# Altium project opm.PrjPcb (part 10 of 11)

## Sheet regulation.SchDoc: Power Regulation
size A4; Author: Peilin Perry Xu; CompanyName: N/A; DrawnBy: Peilin Perry Xu; Engineer: Peilin Perry Xu; Organization: N/A; Address1: 89 Chestnut Street, Toronto, ON, Canada; Address2: 79 Brass Drive, Richmond Hill, ON, Canada; DocumentNumber: 6; Revision: 1; SheetNumber: 9; SheetTotal: 11
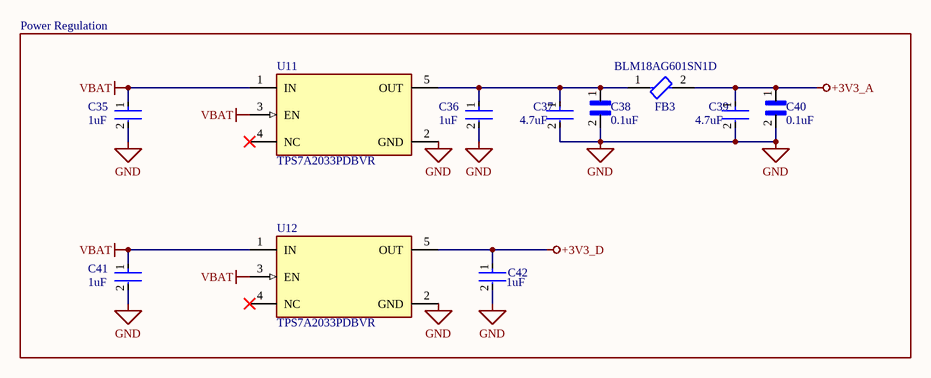
[diagram p9: regulation.SchDoc]

### Parts
C35  1uF  [CC0805KKX7R7BB106]
C36  1uF  [CC0805KKX7R7BB106]
C37  4.7uF  [CC0805KKX7R7BB106]
C38  0.1uF  [CC0603JRX7R8BB104]
C39  4.7uF  [CC0805KKX7R7BB106]
C40  0.1uF  [CC0603JRX7R8BB104]
C41  1uF  [CC0805KKX7R7BB106]
C42  1uF  [CC0805KKX7R7BB106]
FB3  BLM18AG601SN1D  [BLM18AG601SN1D]
U11  TPS7A2033PDBVR  [TPS7A2033PDBVR]
U12  TPS7A2033PDBVR  [TPS7A2033PDBVR]

### Blocks framed on the sheet
Power Regulation: C35-C42 FB3 U11 U12

### Nets
+3V3_A: C39.1 C40.1 FB3.2
+3V3_D: C42.1 U12.5(OUT)
GND: C35.2 C36.2 C37.2 C38.2 C39.2 C40.2 C41.2 C42.2 U11.2(GND) U12.2(GND)  [project net DGND]
VBAT: C35.1 C41.1 U11.1(IN) U11.3(EN) U12.1(IN) U12.3(EN)
NetC36_1: C36.1 C37.1 C38.1 FB3.1 U11.5(OUT)

Not connected (* = marked no-connect by the designer): U11 4(NC)*; U12 4(NC)*

### Library data of the parts
C35 C36 C41 C42 = CC0805KKX7R7BB105: 16V 1uF X7R ±10% 0805 Multilayer Ceramic Capacitors MLCC - SMD/SMT ROHS; Manufacturer: Yageo Group; Manufacturer Package Identifier: CC0805-0.85; Value: 1µF; Supplier: DigiKey; Supplier Part Number: 311-1365-1-ND; Manufacturer Part Number: CC0805KKX7R7BB105; RoHS: Compliant; Category: Ceramic Capacitors; Stock: 898629; Pricing: 1=0.13, 10=0.072, 50=0.05, 100=0.0434, 500=0.0323, 1000=0.02889 (USD); Case/Package: 0805; Case Code (Imperial): 0805; Case Code (Metric): 2012; China RoHS: Compliant; Country of Origin: Mainland China, Taiwan; Depth: 1.25mm; Dielectric: X7R; Dielectric Material: Ceramic; Export Control Classification Number (ECCN) Code: EAR99; Halogen Free: Halogen Free; Height: 1.25mm; Harmonized Tariff Schedule (HTS) Code: 8532.24.00.20; Introduction Date: 2009-04-17; Lead Free: Lead Free; Length: 2mm; Lifecycle Status: Production; Material: Ceramic; Max Operating Temperature: 125°C; Min Operating Temperature: -55°C; Mounting Technology: Surface Mount; Pins: 2; Number of Terminals: 2; Radiation Hardening: No; REACH SVHC: Yes; Schedule B: 8532240020, 8532240020|8532240020|8532240020|8532240020|8532240020|8532240020|8532240020|8532240020|8532240020|8532240020|8532240020|8532240020, 8532240020|8532240020|8532240020|8532240020|8532240020|8532240020|8532240020|8532240020|8532240020|8532240020|8532240020|8532240020|8532240020, 8532240020|8532240020|8532240020|8532240020|8532240020|8532240020|8532240020|8532240020|8532240020|8532240020|8532240020|8532240020|8532240020|8532240020; Termination: SMD/SMT; Thickness: 1.2446mm; Tolerance: 10%; Voltage Rating: 16V; Voltage Rating (DC): 16V; Width: 1.25mm; ComponentLink1URL: https://datasheet.octopart.com:443/CC0805KKX7R7BB105-Yageo-datasheet-177165144.pdf?src-supplier=IHS; ComponentLink1Description: https://datasheet.octopart.com:443/CC0805KKX7R7BB105-Yageo-datasheet-177165144.pdf?src-supplier=IHS; ComponentLink2URL: https://datasheet.octopart.com:443/CC0805KKX7R7BB105-Yageo-datasheet-78855689.pdf?src-supplier=Upverter; ComponentLink2Description: https://datasheet.octopart.com:443/CC0805KKX7R7BB105-Yageo-datasheet-78855689.pdf?src-supplier=Upverter; ComponentLink3URL: https://datasheet.octopart.com:443/CC0805KKX7R7BB105-Yageo-Group-datasheet-189192896.pdf?src-supplier=Future+Electronics; ComponentLink3Description: https://datasheet.octopart.com:443/CC0805KKX7R7BB105-Yageo-Group-datasheet-189192896.pdf?src-supplier=Future+Electronics; ComponentLink4URL: https://datasheet.octopart.com:443/CC0805KKX7R7BB105-Yageo-datasheet-166511530.pdf?src-supplier=Future+Electronics; ComponentLink4Description: https://datasheet.octopart.com:443/CC0805KKX7R7BB105-Yageo-datasheet-166511530.pdf?src-supplier=Future+Electronics; ComponentLink5URL: https://datasheet.octopart.com:443/CC0805KKX7R7BB105-Yageo-datasheet-137700082.pdf?src-supplier=Future+Electronics; ComponentLink5Description: https://datasheet.octopart.com:443/CC0805KKX7R7BB105-Yageo-datasheet-137700082.pdf?src-supplier=Future+Electronics; ComponentLink6URL: https://datasheet.octopart.com:443/CC0805KKX7R7BB105-Yageo-datasheet-137700084.pdf?src-supplier=Future+Electronics; ComponentLink6Description: https://datasheet.octopart.com:443/CC0805KKX7R7BB105-Yageo-datasheet-137700084.pdf?src-supplier=Future+Electronics; ComponentLink7URL: https://datasheet.octopart.com:443/CC0805KKX7R7BB105-Yageo-datasheet-27626582.pdf?src-supplier=Future+Electronics; ComponentLink7Description: https://datasheet.octopart.com:443/CC0805KKX7R7BB105-Yageo-datasheet-27626582.pdf?src-supplier=Future+Electronics; ComponentLink8URL: https://datasheet.octopart.com:443/CC0805KKX7R7BB105-Yageo-datasheet-15895757.pdf?src-supplier=Future+Electronics; ComponentLink8Description: https://datasheet.octopart.com:443/CC0805KKX7R7BB105-Yageo-datasheet-15895757.pdf?src-supplier=Future+Electronics; ComponentLink9URL: https://datasheet.octopart.com:443/CC0805KKX7R7BB105-Yageo-datasheet-12526321.pdf?src-supplier=Future+Electronics; ComponentLink9Description: https://datasheet.octopart.com:443/CC0805KKX7R7BB105-Yageo-datasheet-12526321.pdf?src-supplier=Future+Electronics; ComponentLink10URL: https://datasheet.octopart.com:443/CC0805KKX7R7BB105-Yageo-datasheet-10911834.pdf?src-supplier=Future+Electronics; ComponentLink10Description: https://datasheet.octopart.com:443/CC0805KKX7R7BB105-Yageo-datasheet-10911834.pdf?src-supplier=Future+Electronics; ComponentLink11URL: https://datasheet.octopart.com:443/CC0805KKX7R7BB105-Yageo-datasheet-8324442.pdf?src-supplier=Future+Electronics; ComponentLink11Description: https://datasheet.octopart.com:443/CC0805KKX7R7BB105-Yageo-datasheet-8324442.pdf?src-supplier=Future+Electronics; ComponentLink12URL: https://datasheet.octopart.com/CC0805KKX7R7BB105-Yageo-datasheet-10883670.pdf; ComponentLink12Description: https://datasheet.octopart.com/CC0805KKX7R7BB105-Yageo-datasheet-10883670.pdf; ComponentLink13URL: https://datasheet.octopart.com:443/CC0805KKX7R7BB105-Yageo-datasheet-140260305.pdf?src-supplier=SOS+electronic; ComponentLink13Description: https://datasheet.octopart.com:443/CC0805KKX7R7BB105-Yageo-datasheet-140260305.pdf?src-supplier=SOS+electronic; ComponentLink14URL: https://datasheet.octopart.com:443/CC0805KKX7R7BB105-Yageo-datasheet-147453679.pdf?src-supplier=Farnell; ComponentLink14Description: https://datasheet.octopart.com:443/CC0805KKX7R7BB105-Yageo-datasheet-147453679.pdf?src-supplier=Farnell; ComponentLink15URL: https://datasheet.octopart.com:443/CC0805KKX7R7BB105-Yageo-datasheet-181969634.pdf?src-supplier=Farnell; ComponentLink15Description: https://datasheet.octopart.com:443/CC0805KKX7R7BB105-Yageo-datasheet-181969634.pdf?src-supplier=Farnell; ComponentLink16URL: https://datasheet.octopart.com:443/CC0805KKX7R7BB105-Yageo-datasheet-62336348.pdf?src-supplier=element14+APAC; ComponentLink16Description: https://datasheet.octopart.com:443/CC0805KKX7R7BB105-Yageo-datasheet-62336348.pdf?src-supplier=element14+APAC; ComponentLink17URL: https://datasheet.octopart.com:443/CC0805KKX7R7BB105-Yageo-Group-datasheet-165992755.pdf?src-supplier=ODG+(Origin+Data+Global); ComponentLink17Description: https://datasheet.octopart.com:443/CC0805KKX7R7BB105-Yageo-Group-datasheet-165992755.pdf?src-supplier=ODG+(Origin+Data+Global); ComponentLink18URL: https://datasheet.octopart.com:443/CC0805KKX7R7BB105-Yageo-datasheet-151948686.pdf?src-supplier=TME; ComponentLink18Description: https://datasheet.octopart.com:443/CC0805KKX7R7BB105-Yageo-datasheet-151948686.pdf?src-supplier=TME; ComponentLink19URL: https://datasheet.octopart.com:443/CC0805KKX7R7BB105-Yageo-datasheet-8324192.pdf?src-supplier=TME; ComponentLink19Description: https://datasheet.octopart.com:443/CC0805KKX7R7BB105-Yageo-datasheet-8324192.pdf?src-supplier=TME; ComponentLink20URL: https://datasheet.octopart.com:443/CC0805KKX7R7BB105-Yageo-datasheet-120101875.pdf?src-supplier=Megastar; ComponentLink20Description: https://datasheet.octopart.com:443/CC0805KKX7R7BB105-Yageo-datasheet-120101875.pdf?src-supplier=Megastar; ComponentLink21URL: https://datasheet.octopart.com:443/CC0805KKX7R7BB105-Yageo-datasheet-8701427.pdf?src-supplier=element14; ComponentLink21Description: https://datasheet.octopart.com:443/CC0805KKX7R7BB105-Yageo-datasheet-8701427.pdf?src-supplier=element14; ComponentLink22URL: https://datasheet.octopart.com:443/CC0805KKX7R7BB105-Yageo-datasheet-499490.pdf?src-supplier=element14; ComponentLink22Description: https://datasheet.octopart.com:443/CC0805KKX7R7BB105-Yageo-datasheet-499490.pdf?src-supplier=element14; ComponentLink23URL: https://datasheet.octopart.com:443/CC0805KKX7R7BB105-Yageo-datasheet-5301394.pdf?src-supplier=element14; ComponentLink23Description: https://datasheet.octopart.com:443/CC0805KKX7R7BB105-Yageo-datasheet-5301394.pdf?src-supplier=element14; ComponentLink24URL: http://sigma.octopart.com:80/conflict_mineral_statement/Yageo-company-3.pdf?src-supplier=Compliance+Statements; ComponentLink24Description: http://sigma.octopart.com:80/conflict_mineral_statement/Yageo-company-3.pdf?src-supplier=Compliance+Statements; ComponentLink25URL: http://sigma.octopart.com:80/rohs_statement/Yageo-company-2.pdf?src-supplier=Compliance+Statements; ComponentLink25Description: http://sigma.octopart.com:80/rohs_statement/Yageo-company-2.pdf?src-supplier=Compliance+Statements; Supplier 1: DigiKey; Supplier Part Number 1: 311-1365-1-ND
C37 C39 = CC0805KKX7R7BB475: 16V 4.7uF X7R ±10% 0805 Multilayer Ceramic Capacitors MLCC - SMD/SMT ROHS; Manufacturer: Yageo Group; Manufacturer Package Identifier: CC0805-0.85; Value: 4.7µF; Supplier: DigiKey; Supplier Part Number: 311-1883-1-ND; Manufacturer Part Number: CC0805KKX7R7BB475; RoHS: Compliant; Category: Ceramic Capacitors; Stock: 16960; Pricing: 1=0.38, 10=0.224, 50=0.1656, 100=0.1475, 500=0.11696, 1000=0.10755 (USD); Case/Package: 0805; Case Code (Imperial): 0805; Case Code (Metric): 2012; China RoHS: Compliant; Composition: Ceramic; Dielectric: X7R; Dielectric Material: Ceramic; Halogen Free: Halogen Free; Height: 1.25mm; Lead Free: Lead Free; Length: 2mm; Lifecycle Status: Production; Material: Ceramic; Max Operating Temperature: 125°C; Min Operating Temperature: -55°C; Mounting Technology: Surface Mount; Number of Terminals: 2; Packaging: Tape & Reel (TR); REACH SVHC: Yes; Schedule B: 8532240020, 8532240020|8532240020, 8532240020|8532240020|8532240020, 8532240020|8532240020|8532240020|8532240020; Termination: SMD/SMT; Thickness: 1.4478mm; Tolerance: 10%; Voltage Rating: 16V; Voltage Rating (DC): 16V; Weight: 5.499807mg; Width: 1.25mm; ComponentLink1URL: https://datasheet.octopart.com:443/CC0805KKX7R7BB475-Yageo-datasheet-177165144.pdf?src-supplier=IHS; ComponentLink1Description: https://datasheet.octopart.com:443/CC0805KKX7R7BB475-Yageo-datasheet-177165144.pdf?src-supplier=IHS; ComponentLink2URL: https://datasheet.octopart.com:443/CC0805KKX7R7BB475-Yageo-datasheet-78855689.pdf?src-supplier=Upverter; ComponentLink2Description: https://datasheet.octopart.com:443/CC0805KKX7R7BB475-Yageo-datasheet-78855689.pdf?src-supplier=Upverter; ComponentLink3URL: https://datasheet.octopart.com:443/CC0805KKX7R7BB475-Yageo-datasheet-181969646.pdf?src-supplier=Newark; ComponentLink3Description: https://datasheet.octopart.com:443/CC0805KKX7R7BB475-Yageo-datasheet-181969646.pdf?src-supplier=Newark; ComponentLink4URL: https://datasheet.octopart.com:443/CC0805KKX7R7BB475-Yageo-datasheet-181969644.pdf?src-supplier=Newark; ComponentLink4Description: https://datasheet.octopart.com:443/CC0805KKX7R7BB475-Yageo-datasheet-181969644.pdf?src-supplier=Newark; ComponentLink5URL: https://datasheet.octopart.com:443/CC0805KKX7R7BB475-Yageo-datasheet-140260305.pdf?src-supplier=Newark; ComponentLink5Description: https://datasheet.octopart.com:443/CC0805KKX7R7BB475-Yageo-datasheet-140260305.pdf?src-supplier=Newark; ComponentLink6URL: https://datasheet.octopart.com:443/CC0805KKX7R7BB475-Yageo-datasheet-147453679.pdf?src-supplier=Newark; ComponentLink6Description: https://datasheet.octopart.com:443/CC0805KKX7R7BB475-Yageo-datasheet-147453679.pdf?src-supplier=Newark; ComponentLink7URL: https://datasheet.octopart.com:443/CC0805KKX7R7BB475-Yageo-Group-datasheet-188689702.pdf?src-supplier=Farnell; ComponentLink7Description: https://datasheet.octopart.com:443/CC0805KKX7R7BB475-Yageo-Group-datasheet-188689702.pdf?src-supplier=Farnell; ComponentLink8URL: https://datasheet.octopart.com:443/CC0805KKX7R7BB475-Yageo-datasheet-166511530.pdf?src-supplier=Future+Electronics; ComponentLink8Description: https://datasheet.octopart.com:443/CC0805KKX7R7BB475-Yageo-datasheet-166511530.pdf?src-supplier=Future+Electronics; ComponentLink9URL: https://datasheet.octopart.com:443/CC0805KKX7R7BB475-Yageo-datasheet-137700082.pdf?src-supplier=Future+Electronics; ComponentLink9Description: https://datasheet.octopart.com:443/CC0805KKX7R7BB475-Yageo-datasheet-137700082.pdf?src-supplier=Future+Electronics; ComponentLink10URL: https://datasheet.octopart.com:443/CC0805KKX7R7BB475-Yageo-datasheet-27626582.pdf?src-supplier=Future+Electronics; ComponentLink10Description: https://datasheet.octopart.com:443/CC0805KKX7R7BB475-Yageo-datasheet-27626582.pdf?src-supplier=Future+Electronics; ComponentLink11URL: https://datasheet.octopart.com:443/CC0805KKX7R7BB475-Yageo-Group-datasheet-165992755.pdf?src-supplier=ODG+(Origin+Data+Global); ComponentLink11Description: https://datasheet.octopart.com:443/CC0805KKX7R7BB475-Yageo-Group-datasheet-165992755.pdf?src-supplier=ODG+(Origin+Data+Global); ComponentLink12URL: https://datasheet.octopart.com:443/CC0805KKX7R7BB475-Yageo-datasheet-151948686.pdf?src-supplier=TME; ComponentLink12Description: https://datasheet.octopart.com:443/CC0805KKX7R7BB475-Yageo-datasheet-151948686.pdf?src-supplier=TME; ComponentLink13URL: https://datasheet.octopart.com/Surface-Mount-Ceramic-Multilayer-Capacitors%3B-General-Purpose-%26-High-Capacitance-Class-2%2C-X7R-Yageo-datasheet-family-114.pdf; ComponentLink13Description: https://datasheet.octopart.com/Surface-Mount-Ceramic-Multilayer-Capacitors%3B-General-Purpose-%26-High-Capacitance-Class-2%2C-X7R-Yageo-datasheet-family-114.pdf; ComponentLink14URL: https://datasheet.octopart.com/CC0805KKX7R7BB475-Yageo-datasheet-10883670.pdf; ComponentLink14Description: https://datasheet.octopart.com/CC0805KKX7R7BB475-Yageo-datasheet-10883670.pdf; ComponentLink15URL: http://sigma.octopart.com:80/rohs_statement/Surface-Mount-Ceramic-Multilayer-Capacitors%3B-General-Purpose-%26-High-Capacitance-Class-2%2C-X7R-Yageo-family-124.pdf?src-supplier=Compliance+Statements; ComponentLink15Description: http://sigma.octopart.com:80/rohs_statement/Surface-Mount-Ceramic-Multilayer-Capacitors%3B-General-Purpose-%26-High-Capacitance-Class-2%2C-X7R-Yageo-family-124.pdf?src-supplier=Compliance+Statements; ComponentLink16URL: http://sigma.octopart.com:80/reach_statement/Surface-Mount-Ceramic-Multilayer-Capacitors%3B-General-Purpose-%26-High-Capacitance-Class-2%2C-X7R-Yageo-family-125.pdf?src-supplier=Compliance+Statements; ComponentLink16Description: http://sigma.octopart.com:80/reach_statement/Surface-Mount-Ceramic-Multilayer-Capacitors%3B-General-Purpose-%26-High-Capacitance-Class-2%2C-X7R-Yageo-family-125.pdf?src-supplier=Compliance+Statements; ComponentLink17URL: http://sigma.octopart.com:80/conflict_mineral_statement/Yageo-company-3.pdf?src-supplier=Compliance+Statements; ComponentLink17Description: http://sigma.octopart.com:80/conflict_mineral_statement/Yageo-company-3.pdf?src-supplier=Compliance+Statements; ComponentLink18URL: http://sigma.octopart.com:80/rohs_statement/Yageo-company-2.pdf?src-supplier=Compliance+Statements; ComponentLink18Description: http://sigma.octopart.com:80/rohs_statement/Yageo-company-2.pdf?src-supplier=Compliance+Statements; Supplier 1: DigiKey; Supplier Part Number 1: 311-1883-6-ND
C38 C40 = CC0603JRX7R8BB104: 25V 100nF X7R ±5% 0603 Multilayer Ceramic Capacitors MLCC - SMD/SMT ROHS; Manufacturer: Yageo Group; Supplier: DigiKey; Supplier Part Number: 311-1777-1-ND; Manufacturer Part Number: CC0603JRX7R8BB104; RoHS: Compliant; Category: Ceramic Capacitors; Stock: 156739; Pricing: 1=0.1, 10=0.056, 50=0.0386, 100=0.0333, 500=0.02444, 1000=0.02172 (USD); Value: 100nF; Case/Package: 0603; Case Code (Imperial): 0603; Case Code (Metric): 1608; China RoHS: Compliant; Composition: Ceramic; Depth: 800µm; Dielectric: X7R; Dielectric Material: Ceramic; Halogen Free: Halogen Free; Height: 800µm; Lead Free: Lead Free; Length: 1.6mm; Lifecycle Status: Production; Max Operating Temperature: 125°C; Min Operating Temperature: -55°C; Mounting Technology: Surface Mount; Number of Terminals: 2; Radiation Hardening: No; REACH SVHC: Yes; Schedule B: 8532240020, 8532240020|8532240020, 8532240020|8532240020|8532240020, 8532240020|8532240020|8532240020|8532240020; Termination: SMD/SMT; Thickness: 889µm; Tolerance: 5%; Voltage Rating: 25V; Voltage Rating (DC): 25V; Weight: 2.012816mg; Width: 800µm; ComponentLink1URL: https://datasheet.octopart.com:443/CC0603JRX7R8BB104-Yageo-datasheet-177165144.pdf?src-supplier=IHS; ComponentLink1Description: https://datasheet.octopart.com:443/CC0603JRX7R8BB104-Yageo-datasheet-177165144.pdf?src-supplier=IHS; ComponentLink2URL: https://datasheet.octopart.com:443/CC0603JRX7R8BB104-Yageo-datasheet-147453679.pdf?src-supplier=Farnell; ComponentLink2Description: https://datasheet.octopart.com:443/CC0603JRX7R8BB104-Yageo-datasheet-147453679.pdf?src-supplier=Farnell; ComponentLink3URL: https://datasheet.octopart.com:443/CC0603JRX7R8BB104-Yageo-datasheet-181968346.pdf?src-supplier=Farnell; ComponentLink3Description: https://datasheet.octopart.com:443/CC0603JRX7R8BB104-Yageo-datasheet-181968346.pdf?src-supplier=Farnell; ComponentLink4URL: https://datasheet.octopart.com:443/CC0603JRX7R8BB104-Yageo-datasheet-151948686.pdf?src-supplier=TME; ComponentLink4Description: https://datasheet.octopart.com:443/CC0603JRX7R8BB104-Yageo-datasheet-151948686.pdf?src-supplier=TME; ComponentLink5URL: https://datasheet.octopart.com/CC0603JRX7R8BB104-Yageo-datasheet-12526321.pdf; ComponentLink5Description: https://datasheet.octopart.com/CC0603JRX7R8BB104-Yageo-datasheet-12526321.pdf; ComponentLink6URL: https://datasheet.octopart.com/CC0603JRX7R8BB104-Yageo-datasheet-10883670.pdf; ComponentLink6Description: https://datasheet.octopart.com/CC0603JRX7R8BB104-Yageo-datasheet-10883670.pdf; ComponentLink7URL: https://datasheet.octopart.com:443/CC0603JRX7R8BB104-Yageo-datasheet-166511530.pdf?src-supplier=Future+Electronics; ComponentLink7Description: https://datasheet.octopart.com:443/CC0603JRX7R8BB104-Yageo-datasheet-166511530.pdf?src-supplier=Future+Electronics; ComponentLink8URL: https://datasheet.octopart.com:443/CC0603JRX7R8BB104-Yageo-datasheet-137700082.pdf?src-supplier=Future+Electronics; ComponentLink8Description: https://datasheet.octopart.com:443/CC0603JRX7R8BB104-Yageo-datasheet-137700082.pdf?src-supplier=Future+Electronics; ComponentLink9URL: https://datasheet.octopart.com:443/CC0603JRX7R8BB104-Yageo-datasheet-137700084.pdf?src-supplier=Future+Electronics; ComponentLink9Description: https://datasheet.octopart.com:443/CC0603JRX7R8BB104-Yageo-datasheet-137700084.pdf?src-supplier=Future+Electronics; ComponentLink10URL: https://datasheet.octopart.com:443/CC0603JRX7R8BB104-Yageo-datasheet-27626582.pdf?src-supplier=Future+Electronics; ComponentLink10Description: https://datasheet.octopart.com:443/CC0603JRX7R8BB104-Yageo-datasheet-27626582.pdf?src-supplier=Future+Electronics; ComponentLink11URL: https://datasheet.octopart.com:443/CC0603JRX7R8BB104-Yageo-datasheet-15895757.pdf?src-supplier=Future+Electronics; ComponentLink11Description: https://datasheet.octopart.com:443/CC0603JRX7R8BB104-Yageo-datasheet-15895757.pdf?src-supplier=Future+Electronics; ComponentLink12URL: https://datasheet.octopart.com:443/CC0603JRX7R8BB104-Yageo-datasheet-10911834.pdf?src-supplier=Future+Electronics; ComponentLink12Description: https://datasheet.octopart.com:443/CC0603JRX7R8BB104-Yageo-datasheet-10911834.pdf?src-supplier=Future+Electronics; ComponentLink13URL: https://datasheet.octopart.com:443/CC0603JRX7R8BB104-Yageo-datasheet-8324442.pdf?src-supplier=Future+Electronics; ComponentLink13Description: https://datasheet.octopart.com:443/CC0603JRX7R8BB104-Yageo-datasheet-8324442.pdf?src-supplier=Future+Electronics; ComponentLink14URL: https://datasheet.octopart.com:443/CC0603JRX7R8BB104-Yageo-Group-datasheet-165992755.pdf?src-supplier=ODG+(Origin+Data+Global); ComponentLink14Description: https://datasheet.octopart.com:443/CC0603JRX7R8BB104-Yageo-Group-datasheet-165992755.pdf?src-supplier=ODG+(Origin+Data+Global); ComponentLink15URL: http://sigma.octopart.com:80/rohs_statement/Surface-Mount-Ceramic-Multilayer-Capacitors%3B-General-Purpose-%26-High-Capacitance-Class-2%2C-X7R-Yageo-family-124.pdf?src-supplier=Compliance+Statements; ComponentLink15Description: http://sigma.octopart.com:80/rohs_statement/Surface-Mount-Ceramic-Multilayer-Capacitors%3B-General-Purpose-%26-High-Capacitance-Class-2%2C-X7R-Yageo-family-124.pdf?src-supplier=Compliance+Statements; ComponentLink16URL: http://sigma.octopart.com:80/reach_statement/Surface-Mount-Ceramic-Multilayer-Capacitors%3B-General-Purpose-%26-High-Capacitance-Class-2%2C-X7R-Yageo-family-125.pdf?src-supplier=Compliance+Statements; ComponentLink16Description: http://sigma.octopart.com:80/reach_statement/Surface-Mount-Ceramic-Multilayer-Capacitors%3B-General-Purpose-%26-High-Capacitance-Class-2%2C-X7R-Yageo-family-125.pdf?src-supplier=Compliance+Statements; ComponentLink17URL: http://sigma.octopart.com:80/conflict_mineral_statement/Yageo-company-3.pdf?src-supplier=Compliance+Statements; ComponentLink17Description: http://sigma.octopart.com:80/conflict_mineral_statement/Yageo-company-3.pdf?src-supplier=Compliance+Statements; ComponentLink18URL: http://sigma.octopart.com:80/rohs_statement/Yageo-company-2.pdf?src-supplier=Compliance+Statements; ComponentLink18Description: http://sigma.octopart.com:80/rohs_statement/Yageo-company-2.pdf?src-supplier=Compliance+Statements; Supplier 1: DigiKey; Supplier Part Number 1: 311-1777-1-ND
FB3 = BLM18AG601SN1D: Ferrite Beads Multi-Layer 600Ohm 25% 100MHz 500mA 380mOhm DCR 0603 Automotive Paper T/R; Manufacturer: Murata; DC Resistance (DCR): 380mΩ; Impedance: 600Ω; Material: Ferrite, Steel; Number of Circuits: 1; Value: 380mΩ; Shielding: Unshielded; Supplier: DigiKey; Supplier Part Number: 490-1014-1-ND; Manufacturer Part Number: BLM18AG601SN1D; RoHS: Compliant; Category: Ferrite Beads and Chips; Stock: 1054512; Pricing: 1=0.1, 10=0.057, 25=0.0496, 50=0.0446, 100=0.0401, 250=0.03456, 500=0.03076, 1000=0.02726 (USD); Case/Package: 0603; Case Code (Imperial): 0603; Case Code (Metric): 1608; Core Material: Ferrite; Country of Origin: Japan, Thailand; Current Rating: 500mA; DC Current: 500mA; Depth: 800µm; Export Control Classification Number (ECCN) Code: EAR99; Frequency: 100MHz; Height: 800µm; Harmonized Tariff Schedule (HTS) Code: 8504.50.80.00; Introduction Date: 2001-08-28; Lead Free: Lead Free; Length: 1.6mm; Lifecycle Status: Production; Max Current Rating: 500mA; Max DC Current: 500mA; Clock Frequency: 100MHz; Max Operating Temperature: 125°C; Military Standard: Not; Min Operating Temperature: -55°C; Number of Lines: 1; Pins: 2; Number of Terminals: 2; Packaging: Cut Tape; Radiation Hardening: No; REACH SVHC: Yes; RMS Current (Irms): 500mA; Schedule B: 8543706000, 8543706000|8543706000, 8543706000|8543706000|8543706000, 8543706000|8543706000|8543706000|8543706000; ESR: 380mΩ; Termination: SMD/SMT; Test Frequency: 100MHz; Tolerance: 25%; Weight: 2.012816mg; Width: 800µm; ComponentLink1URL: https://datasheet.octopart.com:443/BLM18AG601SN1D-Murata-datasheet-180806579.pdf?src-supplier=IHS; ComponentLink1Description: https://datasheet.octopart.com:443/BLM18AG601SN1D-Murata-datasheet-180806579.pdf?src-supplier=IHS; ComponentLink2URL: https://datasheet.octopart.com:443/BLM18AG601SN1D-Murata-datasheet-41195.pdf?src-supplier=Upverter; ComponentLink2Description: https://datasheet.octopart.com:443/BLM18AG601SN1D-Murata-datasheet-41195.pdf?src-supplier=Upverter; ComponentLink3URL: https://datasheet.octopart.com:443/BLM18AG601SN1D-Murata-datasheet-11743096.pdf?src-supplier=Newark; ComponentLink3Description: https://datasheet.octopart.com:443/BLM18AG601SN1D-Murata-datasheet-11743096.pdf?src-supplier=Newark; ComponentLink4URL: https://datasheet.octopart.com:443/BLM18AG601SN1D-Murata-datasheet-5338592.pdf?src-supplier=Newark; ComponentLink4Description: https://datasheet.octopart.com:443/BLM18AG601SN1D-Murata-datasheet-5338592.pdf?src-supplier=Newark; ComponentLink5URL: https://datasheet.octopart.com:443/BLM18AG601SN1D-Murata-datasheet-511221.pdf?src-supplier=TME; ComponentLink5Description: https://datasheet.octopart.com:443/BLM18AG601SN1D-Murata-datasheet-511221.pdf?src-supplier=TME; ComponentLink6URL: https://datasheet.octopart.com:443/BLM18AG601SN1D-Murata-datasheet-135086656.pdf?src-supplier=TME; ComponentLink6Description: https://datasheet.octopart.com:443/BLM18AG601SN1D-Murata-datasheet-135086656.pdf?src-supplier=TME; ComponentLink7URL: https://datasheet.octopart.com:443/BLM18AG601SN1D-Murata-datasheet-5396529.pdf?src-supplier=Factory+Futures; ComponentLink7Description: https://datasheet.octopart.com:443/BLM18AG601SN1D-Murata-datasheet-5396529.pdf?src-supplier=Factory+Futures; ComponentLink8URL: https://datasheet.octopart.com:443/BLM18AG601SN1D-Murata-datasheet-141257898.pdf?src-supplier=Ciiva; ComponentLink8Description: https://datasheet.octopart.com:443/BLM18AG601SN1D-Murata-datasheet-141257898.pdf?src-supplier=Ciiva; ComponentLink9URL: https://datasheet.octopart.com:443/BLM18AG601SN1D-Murata-datasheet-138706784.pdf?src-supplier=Ciiva; ComponentLink9Description: https://datasheet.octopart.com:443/BLM18AG601SN1D-Murata-datasheet-138706784.pdf?src-supplier=Ciiva; ComponentLink10URL: https://datasheet.octopart.com:443/BLM18AG601SN1D-Murata-datasheet-78375072.pdf?src-supplier=Future+Electronics; ComponentLink10Description: https://datasheet.octopart.com:443/BLM18AG601SN1D-Murata-datasheet-78375072.pdf?src-supplier=Future+Electronics; ComponentLink11URL: https://datasheet.octopart.com:443/BLM18AG601SN1D-Murata-datasheet-58177255.pdf?src-supplier=Future+Electronics; ComponentLink11Description: https://datasheet.octopart.com:443/BLM18AG601SN1D-Murata-datasheet-58177255.pdf?src-supplier=Future+Electronics; ComponentLink12URL: https://datasheet.octopart.com/BLM18AG601SN1D-Murata-datasheet-37129980.pdf; ComponentLink12Description: https://datasheet.octopart.com/BLM18AG601SN1D-Murata-datasheet-37129980.pdf; ComponentLink13URL: https://datasheet.octopart.com:443/BLM18AG601SN1D-Murata-datasheet-14066397.pdf?src-supplier=iiiC; ComponentLink13Description: https://datasheet.octopart.com:443/BLM18AG601SN1D-Murata-datasheet-14066397.pdf?src-supplier=iiiC; ComponentLink14URL: https://datasheet.octopart.com:443/BLM18AG601SN1D-Murata-datasheet-9604654.pdf?src-supplier=RS+(Formerly+Allied+Electronics); ComponentLink14Description: https://datasheet.octopart.com:443/BLM18AG601SN1D-Murata-datasheet-9604654.pdf?src-supplier=RS+(Formerly+Allied+Electronics); ComponentLink15URL: https://datasheet.octopart.com:443/BLM18AG601SN1D-Murata-datasheet-13143.pdf?src-supplier=RS+(Formerly+Allied+Electronics); ComponentLink15Description: https://datasheet.octopart.com:443/BLM18AG601SN1D-Murata-datasheet-13143.pdf?src-supplier=RS+(Formerly+Allied+Electronics); ComponentLink16URL: https://datasheet.octopart.com:443/BLM18AG601SN1D-Murata-datasheet-7628479.pdf?src-supplier=Jameco; ComponentLink16Description: https://datasheet.octopart.com:443/BLM18AG601SN1D-Murata-datasheet-7628479.pdf?src-supplier=Jameco; ComponentLink17URL: https://datasheet.octopart.com:443/BLM18AG601SN1D-Murata-datasheet-11030792.pdf?src-supplier=Farnell; ComponentLink17Description: https://datasheet.octopart.com:443/BLM18AG601SN1D-Murata-datasheet-11030792.pdf?src-supplier=Farnell; ComponentLink18URL: http://sigma.octopart.com:80/reach_statement/Murata-company-16.pdf?src-supplier=Compliance+Statements; ComponentLink18Description: http://sigma.octopart.com:80/reach_statement/Murata-company-16.pdf?src-supplier=Compliance+Statements; Supplier 1: DigiKey; Supplier Part Number 1: 490-1014-1-ND
U11 U12 = TPS7A2033PDBVR: 300mA ultra-low-noise low-IQ low-dropout (LDO) linear regulator with high PSRR 5-SOT-23 -40 to 125; Manufacturer: Texas Instruments; Manufacturer Lifecycle Status: ACTIVE; Accuracy: 1.5%; Dropout Voltage: 145mV; Max Junction Temperature (Tj): 125°C; Max Supply Voltage: 6V; Min Supply Voltage: 1.6V; Nominal Supply Current: 6.5µA; Number of Channels: 1; Output Voltage: 3.3V; Supplier: DigiKey; Supplier Part Number: 296-TPS7A2033PDBVRCT-ND; Manufacturer Part Number: TPS7A2033PDBVR; RoHS: Compliant; Category: LDO Voltage Regulators; Stock: 15596; Pricing: 1=0.32, 10=0.218, 25=0.1936, 100=0.1665, 250=0.15364, 500=0.1459, 1000=0.13951 (USD); Case/Package: SOT-23; Height: 1.45mm; Length: 2.9mm; Lifecycle Status: Production; Max Operating Temperature: 125°C; Min Operating Temperature: -40°C; Number of Outputs: 1; Pins: 5; Output Current: 300mA; Thickness: 1.2mm; Width: 1.6mm; ComponentLink1URL: https://sigma.octopart.com:443/177332311/technical_drawing/Texas-Instruments-TPS7A2033PDBVR.pdf?src-supplier=Texas+Instruments; ComponentLink1Description: https://sigma.octopart.com:443/177332311/technical_drawing/Texas-Instruments-TPS7A2033PDBVR.pdf?src-supplier=Texas+Instruments; ComponentLink2URL: https://octopart.com:443/opatz8j6/c1?t=Ma8ufZnKKk_4ATfb14C_eP2QaxaiRthHQJtKusmYO_-I-6JGC8iIHetUtRdC5_axeXbCEdVp9wf_UwcPfgqubJ4i_D6qxU8SH4zIHwfuYwWyVKByeVOCLRFSq0GW-XiuJKOUh-wBrdD1nXJo4BUqX6aY_fyM7an4T8o1CX0IhOMrpo-oNm9IOAR28j7MeTK7I80W1Eorou5WEQqXmriVDRoiwD2NotTqdNxlTSj-cN8Ykvc373_5CdeRBai5zApiAgYKppeYOSbOx6psnqsn0rxystwDVuxyyyHYJZzgtMnq9lljAfaZpyzHt9L8kxL0UNrlsEGw1j5X7uv7jHvLsJxySSnFKRKe-mWLHk6Ye7ZFi91ueAVDnT7aMGRA6_kgJkxV3l4&src-supplier=Texas+Instruments; ComponentLink2Description: https://octopart.com:443/opatz8j6/c1?t=Ma8ufZnKKk_4ATfb14C_eP2QaxaiRthHQJtKusmYO_-I-6JGC8iIHetUtRdC5_axeXbCEdVp9wf_UwcPfgqubJ4i_D6qxU8SH4zIHwfuYwWyVKByeVOCLRFSq0GW-XiuJKOUh-wBrdD1nXJo4BUqX6aY_fyM7an4T8o1CX0IhOMrpo-oNm9IOAR28j7MeTK7I80W1Eorou5WEQqXmriVDRoiwD2NotTqdNxlTSj-cN8Ykvc373_5CdeRBai5zApiAgYKppeYOSbOx6psnqsn0rxystwDVuxyyyHYJZzgtMnq9lljAfaZpyzHt9L8kxL0UNrlsEGw1j5X7uv7jHvLsJxySSnFKRKe-mWLHk6Ye7ZFi91ueAVDnT7aMGRA6_kgJkxV3l4&src-supplier=Texas+Instruments; ComponentLink3URL: https://sigma.octopart.com:443/175570406/technical_drawing/Texas-Instruments-TPS7A2033PDBVR.pdf?src-supplier=Texas+Instruments; ComponentLink3Description: https://sigma.octopart.com:443/175570406/technical_drawing/Texas-Instruments-TPS7A2033PDBVR.pdf?src-supplier=Texas+Instruments; ComponentLink4URL: https://sigma.octopart.com:443/169406034/technical_drawing/Texas-Instruments-TPS7A2033PDBVR.pdf?src-supplier=Texas+Instruments; ComponentLink4Description: https://sigma.octopart.com:443/169406034/technical_drawing/Texas-Instruments-TPS7A2033PDBVR.pdf?src-supplier=Texas+Instruments; ComponentLink5URL: https://sigma.octopart.com:443/155939316/technical_drawing/Texas-Instruments-TPS7A2033PDBVR.pdf?src-supplier=Texas+Instruments; ComponentLink5Description: https://sigma.octopart.com:443/155939316/technical_drawing/Texas-Instruments-TPS7A2033PDBVR.pdf?src-supplier=Texas+Instruments; ComponentLink6URL: https://datasheet.octopart.com:443/TPS7A2033PDBVR-Texas-Instruments-datasheet-149070019.pdf?src-supplier=Upverter; ComponentLink6Description: https://datasheet.octopart.com:443/TPS7A2033PDBVR-Texas-Instruments-datasheet-149070019.pdf?src-supplier=Upverter; ComponentLink7URL: https://datasheet.octopart.com:443/TPS7A2033PDBVR-Texas-Instruments-datasheet-164420832.pdf?src-supplier=Augswan; ComponentLink7Description: https://datasheet.octopart.com:443/TPS7A2033PDBVR-Texas-Instruments-datasheet-164420832.pdf?src-supplier=Augswan; ComponentLink8URL: https://datasheet.octopart.com:443/TPS7A2033PDBVR-Texas-Instruments-datasheet-159781690.pdf?src-supplier=LCSC; ComponentLink8Description: https://datasheet.octopart.com:443/TPS7A2033PDBVR-Texas-Instruments-datasheet-159781690.pdf?src-supplier=LCSC; ComponentLink9URL: http://sigma.octopart.com:80/reach_statement/Texas-Instruments-company-64.pdf?src-supplier=Compliance+Statements; ComponentLink9Description: http://sigma.octopart.com:80/reach_statement/Texas-Instruments-company-64.pdf?src-supplier=Compliance+Statements; ComponentLink10URL: http://sigma.octopart.com:80/conflict_mineral_statement/Texas-Instruments-company-63.pdf?src-supplier=Compliance+Statements; ComponentLink10Description: http://sigma.octopart.com:80/conflict_mineral_statement/Texas-Instruments-company-63.pdf?src-supplier=Compliance+Statements; Supplier 1: DigiKey; Supplier Part Number 1: 296-TPS7A2033PDBVRCT-ND